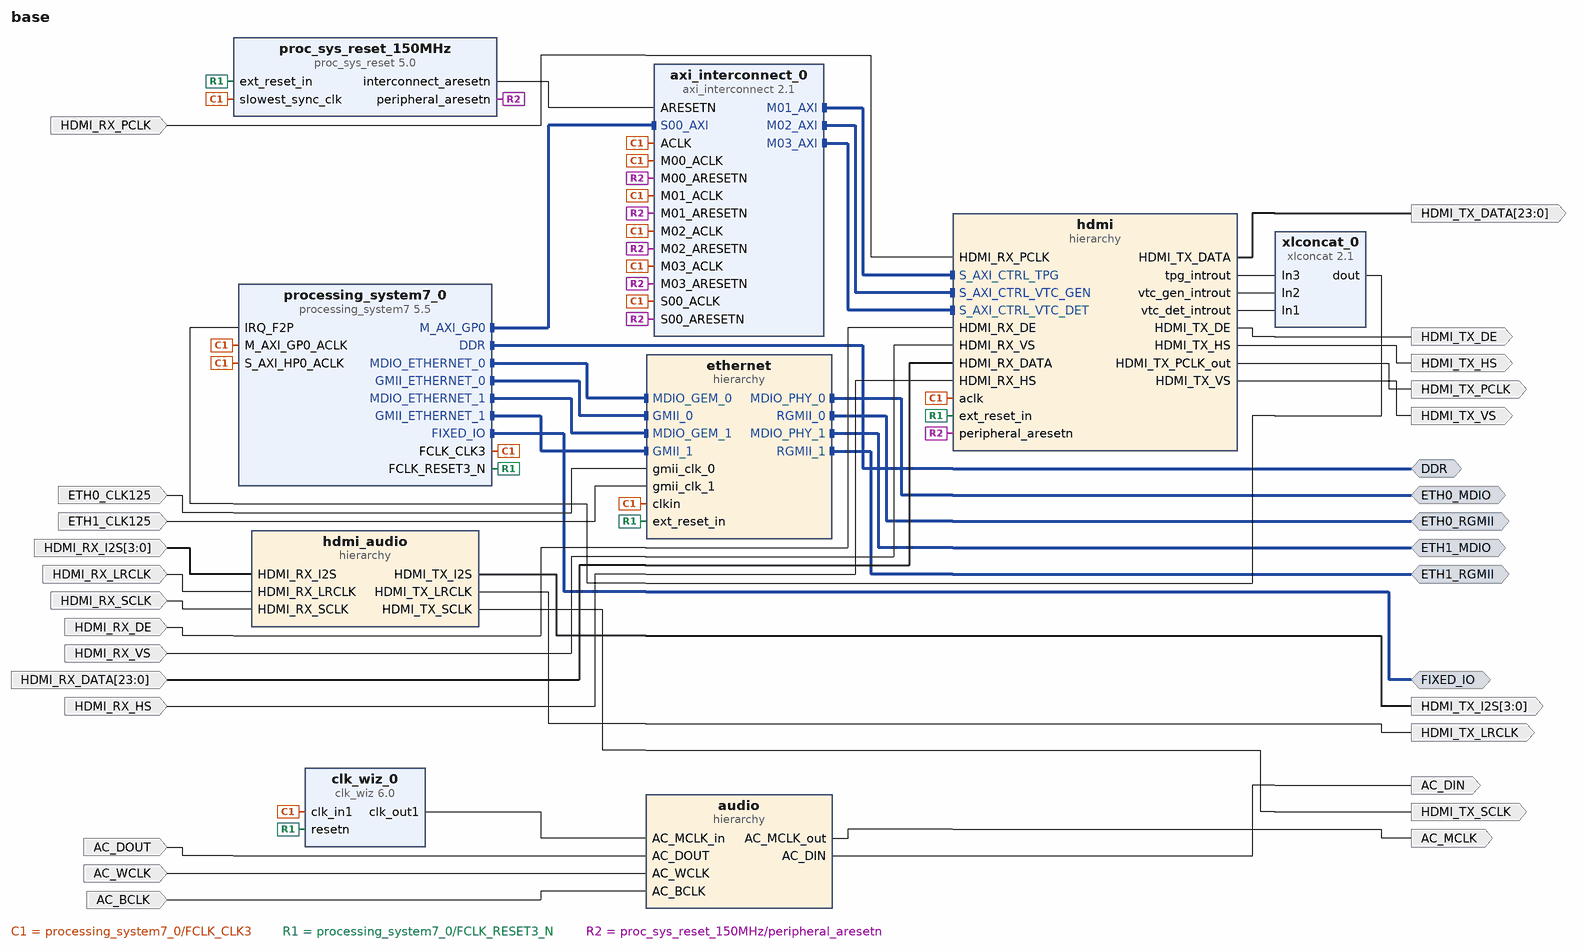
[diagram p0: block diagram of the top level]
# Vivado block design base, xc7z020clg400-3, Vivado 2018.2.1
create_bd_design base

create_bd_intf_port -mode Master -vlnv xilinx.com:interface:ddrx_rtl:1.0 DDR
create_bd_intf_port -mode Master -vlnv xilinx.com:display_processing_system7:fixedio_rtl:1.0 FIXED_IO
create_bd_intf_port -mode Master -vlnv xilinx.com:interface:mdio_rtl:1.0 ETH0_MDIO
create_bd_intf_port -mode Master -vlnv xilinx.com:interface:rgmii_rtl:1.0 ETH0_RGMII
create_bd_intf_port -mode Master -vlnv xilinx.com:interface:mdio_rtl:1.0 ETH1_MDIO
create_bd_intf_port -mode Master -vlnv xilinx.com:interface:rgmii_rtl:1.0 ETH1_RGMII
create_bd_port -dir I -type clk HDMI_RX_PCLK
set_property -dict {CONFIG.FREQ_HZ 148500000} [get_bd_ports HDMI_RX_PCLK]
create_bd_port -dir I -type data AC_DOUT
create_bd_port -dir O -from 23 -to 0 HDMI_TX_DATA
create_bd_port -dir O HDMI_TX_DE
create_bd_port -dir O HDMI_TX_HS
create_bd_port -dir O HDMI_TX_VS
create_bd_port -dir I HDMI_RX_DE
create_bd_port -dir I HDMI_RX_VS
create_bd_port -dir I -from 23 -to 0 -type data HDMI_RX_DATA
create_bd_port -dir I HDMI_RX_HS
create_bd_port -dir O AC_MCLK
create_bd_port -dir O -type data AC_DIN
create_bd_port -dir I AC_WCLK
create_bd_port -dir I AC_BCLK
create_bd_port -dir I -from 3 -to 0 HDMI_RX_I2S
create_bd_port -dir O -from 3 -to 0 HDMI_TX_I2S
create_bd_port -dir I HDMI_RX_LRCLK
create_bd_port -dir I HDMI_RX_SCLK
create_bd_port -dir O HDMI_TX_LRCLK
create_bd_port -dir O HDMI_TX_SCLK
create_bd_port -dir I -type clk ETH0_CLK125
set_property -dict {CONFIG.FREQ_HZ 125000000} [get_bd_ports ETH0_CLK125]
create_bd_port -dir O -type clk HDMI_TX_PCLK
create_bd_port -dir I -type clk ETH1_CLK125
set_property -dict {CONFIG.FREQ_HZ 125000000 CONFIG.CLK_DOMAIN base_gmii_clk_0} [get_bd_ports ETH1_CLK125]

create_bd_cell -type ip -vlnv xilinx.com:ip:xlconcat:2.1 xlconcat_0
set_property -dict {CONFIG.NUM_PORTS 6 CONFIG.IN0_WIDTH 11} [get_bd_cells xlconcat_0]
create_bd_cell -type ip -vlnv xilinx.com:ip:processing_system7:5.5 processing_system7_0
set_property -dict [list \
  CONFIG.PCW_UIPARAM_DDR_FREQ_MHZ 400 \
  CONFIG.PCW_CPU_CPU_6X4X_MAX_RANGE 867 \
  CONFIG.PCW_CRYSTAL_PERIPHERAL_FREQMHZ 33.333 \
  CONFIG.PCW_APU_PERIPHERAL_FREQMHZ 867 \
  CONFIG.PCW_SDIO_PERIPHERAL_FREQMHZ 100 \
  CONFIG.PCW_UART_PERIPHERAL_FREQMHZ 50 \
  CONFIG.PCW_I2C_PERIPHERAL_FREQMHZ 144.442993 \
  CONFIG.PCW_FPGA0_PERIPHERAL_FREQMHZ 50 \
  CONFIG.PCW_FPGA1_PERIPHERAL_FREQMHZ 100 \
  CONFIG.PCW_FPGA2_PERIPHERAL_FREQMHZ 150 \
  CONFIG.PCW_FPGA3_PERIPHERAL_FREQMHZ 200 \
  CONFIG.PCW_USE_S_AXI_HP0 1 \
  CONFIG.PCW_USE_FABRIC_INTERRUPT 1 \
  CONFIG.PCW_S_AXI_HP0_DATA_WIDTH 32 \
  CONFIG.PCW_EN_CLK1_PORT 1 \
  CONFIG.PCW_EN_CLK2_PORT 1 \
  CONFIG.PCW_EN_CLK3_PORT 1 \
  CONFIG.PCW_EN_RST1_PORT 1 \
  CONFIG.PCW_EN_RST2_PORT 1 \
  CONFIG.PCW_EN_RST3_PORT 1 \
  CONFIG.PCW_IRQ_F2P_INTR 1 \
  CONFIG.PCW_PERIPHERAL_BOARD_PRESET part0 \
  CONFIG.PCW_PRESET_BANK0_VOLTAGE {LVCMOS 1.8V} \
  CONFIG.PCW_PRESET_BANK1_VOLTAGE {LVCMOS 1.8V} \
  CONFIG.PCW_UIPARAM_DDR_MEMORY_TYPE {LPDDR 2} \
  CONFIG.PCW_UIPARAM_DDR_PARTNO Custom \
  CONFIG.PCW_QSPI_PERIPHERAL_ENABLE 1 \
  CONFIG.PCW_QSPI_QSPI_IO {MIO 1 .. 6} \
  CONFIG.PCW_QSPI_GRP_SINGLE_SS_ENABLE 1 \
  CONFIG.PCW_QSPI_GRP_SINGLE_SS_IO {MIO 1 .. 6} \
  CONFIG.PCW_SINGLE_QSPI_DATA_MODE x4 \
  CONFIG.PCW_QSPI_GRP_FBCLK_ENABLE 1 \
  CONFIG.PCW_QSPI_GRP_FBCLK_IO {MIO 8} \
  CONFIG.PCW_ENET0_PERIPHERAL_ENABLE 1 \
  CONFIG.PCW_ENET0_ENET0_IO EMIO \
  CONFIG.PCW_ENET0_GRP_MDIO_ENABLE 1 \
  CONFIG.PCW_ENET0_GRP_MDIO_IO EMIO \
  CONFIG.PCW_ENET_RESET_ENABLE 1 \
  CONFIG.PCW_ENET_RESET_SELECT {Share reset pin} \
  CONFIG.PCW_ENET0_RESET_ENABLE 0 \
  CONFIG.PCW_ENET1_PERIPHERAL_ENABLE 1 \
  CONFIG.PCW_ENET1_ENET1_IO EMIO \
  CONFIG.PCW_ENET1_GRP_MDIO_ENABLE 1 \
  CONFIG.PCW_ENET1_GRP_MDIO_IO EMIO \
  CONFIG.PCW_SD0_PERIPHERAL_ENABLE 1 \
  CONFIG.PCW_SD0_SD0_IO {MIO 40 .. 45} \
  CONFIG.PCW_SD0_GRP_CD_ENABLE 0 \
  CONFIG.PCW_SD0_GRP_WP_ENABLE 0 \
  CONFIG.PCW_SD1_PERIPHERAL_ENABLE 1 \
  CONFIG.PCW_SD1_SD1_IO {MIO 10 .. 15} \
  CONFIG.PCW_UART0_PERIPHERAL_ENABLE 1 \
  CONFIG.PCW_UART0_UART0_IO {MIO 50 .. 51} \
  CONFIG.PCW_UART1_PERIPHERAL_ENABLE 0 \
  CONFIG.PCW_SPI1_PERIPHERAL_ENABLE 1 \
  CONFIG.PCW_SPI1_SPI1_IO {MIO 46 .. 51} \
  CONFIG.PCW_USB0_PERIPHERAL_ENABLE 1 \
  CONFIG.PCW_USB0_USB0_IO {MIO 28 .. 39} \
  CONFIG.PCW_USB_RESET_ENABLE 1 \
  CONFIG.PCW_USB_RESET_SELECT {Share reset pin} \
  CONFIG.PCW_USB0_RESET_ENABLE 0 \
  CONFIG.PCW_I2C1_PERIPHERAL_ENABLE 1 \
  CONFIG.PCW_I2C1_I2C1_IO {MIO 24 .. 25} \
  CONFIG.PCW_I2C_RESET_ENABLE 1 \
  CONFIG.PCW_I2C_RESET_SELECT {Share reset pin} \
  CONFIG.PCW_GPIO_PERIPHERAL_ENABLE 1 \
  CONFIG.PCW_GPIO_MIO_GPIO_ENABLE 1 \
  CONFIG.PCW_GPIO_MIO_GPIO_IO MIO \
  CONFIG.PCW_GPIO_EMIO_GPIO_ENABLE 1 \
  CONFIG.PCW_GPIO_EMIO_GPIO_IO 64 \
  CONFIG.PCW_FPGA_FCLK1_ENABLE 1 \
  CONFIG.PCW_FPGA_FCLK2_ENABLE 1 \
  CONFIG.PCW_FPGA_FCLK3_ENABLE 1 \
] [get_bd_cells processing_system7_0]
# 527 more settings of processing_system7_0 are not shown: defaults, MIO pin electricals, DDR timing, and values the tool derives
create_bd_cell -type hier hdmi
create_bd_cell -type hier ethernet
create_bd_cell -type ip -vlnv xilinx.com:ip:axi_interconnect:2.1 axi_interconnect_0
set_property -dict {CONFIG.NUM_MI 4} [get_bd_cells axi_interconnect_0]
create_bd_cell -type ip -vlnv xilinx.com:ip:proc_sys_reset:5.0 proc_sys_reset_150MHz
create_bd_cell -type hier audio
create_bd_cell -type hier hdmi_audio
create_bd_cell -type ip -vlnv xilinx.com:ip:clk_wiz:6.0 clk_wiz_0
set_property -dict [list \
  CONFIG.USE_DYN_RECONFIG false \
  CONFIG.CLKOUT2_USED false \
  CONFIG.NUM_OUT_CLKS 1 \
  CONFIG.CLKOUT1_REQUESTED_OUT_FREQ 12 \
  CONFIG.CLKOUT2_REQUESTED_OUT_FREQ 12 \
  CONFIG.PRIM_SOURCE Global_buffer \
  CONFIG.RESET_PORT resetn \
  CONFIG.MMCM_DIVCLK_DIVIDE 11 \
  CONFIG.MMCM_CLKFBOUT_MULT_F 54.125 \
  CONFIG.MMCM_CLKIN2_PERIOD 10.0 \
  CONFIG.MMCM_CLKOUT0_DIVIDE_F 82.000 \
  CONFIG.MMCM_CLKOUT1_DIVIDE 1 \
  CONFIG.RESET_TYPE ACTIVE_LOW \
  CONFIG.CLKOUT1_JITTER 353.202 \
  CONFIG.CLKOUT1_PHASE_ERROR 344.060 \
  CONFIG.CLKOUT2_JITTER 353.202 \
  CONFIG.CLKOUT2_PHASE_ERROR 344.060 \
  CONFIG.AXI_DRP false \
  CONFIG.PHASE_DUTY_CONFIG false \
] [get_bd_cells clk_wiz_0]

# ---- hierarchy /hdmi ----
current_bd_instance /hdmi
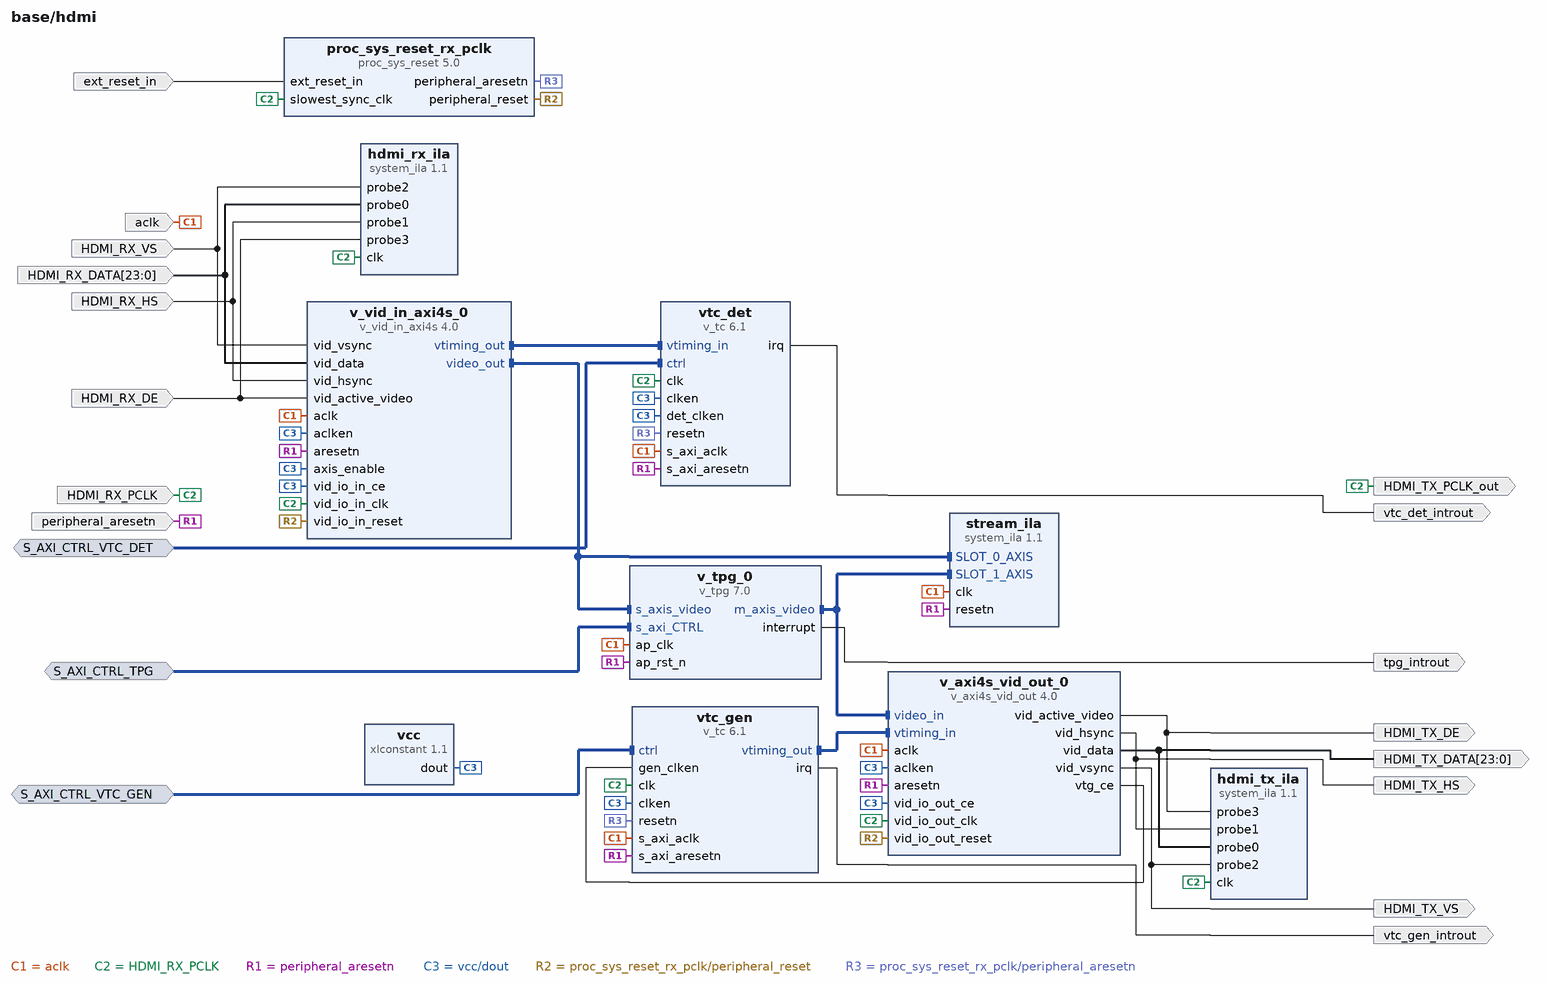
[diagram p1: block diagram inside /hdmi]
create_bd_intf_pin -mode Slave -vlnv xilinx.com:interface:aximm_rtl:1.0 S_AXI_CTRL_TPG
create_bd_intf_pin -mode Slave -vlnv xilinx.com:interface:aximm_rtl:1.0 S_AXI_CTRL_VTC_GEN
create_bd_intf_pin -mode Slave -vlnv xilinx.com:interface:aximm_rtl:1.0 S_AXI_CTRL_VTC_DET
create_bd_pin -dir I -type clk aclk
create_bd_pin -dir I -type rst ext_reset_in
create_bd_pin -dir I -type clk HDMI_RX_PCLK
create_bd_pin -dir O -from 23 -to 0 HDMI_TX_DATA
create_bd_pin -dir O HDMI_TX_DE
create_bd_pin -dir O HDMI_TX_HS
create_bd_pin -dir O HDMI_TX_VS
create_bd_pin -dir I HDMI_RX_DE
create_bd_pin -dir I HDMI_RX_VS
create_bd_pin -dir I -from 23 -to 0 HDMI_RX_DATA
create_bd_pin -dir I HDMI_RX_HS
create_bd_pin -dir O -type intr vtc_gen_introut
create_bd_pin -dir O tpg_introut
create_bd_pin -dir I -type rst peripheral_aresetn
create_bd_pin -dir O -type intr vtc_det_introut
create_bd_pin -dir O HDMI_TX_PCLK_out

create_bd_cell -type ip -vlnv xilinx.com:ip:v_axi4s_vid_out:4.0 v_axi4s_vid_out_0
set_property -dict {CONFIG.C_HAS_ASYNC_CLK 1 CONFIG.C_ADDR_WIDTH 5 CONFIG.C_VTG_MASTER_SLAVE 0} [get_bd_cells v_axi4s_vid_out_0]
create_bd_cell -type ip -vlnv xilinx.com:ip:system_ila:1.1 hdmi_tx_ila
set_property -dict [list \
  CONFIG.C_PROBE0_TYPE 1 \
  CONFIG.C_PROBE0_WIDTH 24 \
  CONFIG.C_DATA_DEPTH 4096 \
  CONFIG.C_NUM_OF_PROBES 4 \
  CONFIG.C_MON_TYPE NATIVE \
  CONFIG.C_PROBE_WIDTH_PROPAGATION MANUAL \
] [get_bd_cells hdmi_tx_ila]
create_bd_cell -type ip -vlnv xilinx.com:ip:xlconstant:1.1 vcc
create_bd_cell -type ip -vlnv xilinx.com:ip:system_ila:1.1 stream_ila
set_property -dict [list \
  CONFIG.C_SLOT 0 \
  CONFIG.C_DATA_DEPTH 4096 \
  CONFIG.C_NUM_OF_PROBES 1 \
  CONFIG.C_NUM_MONITOR_SLOTS 2 \
  CONFIG.C_SLOT_0_INTF_TYPE xilinx.com:interface:axis_rtl:1.0 \
  CONFIG.C_SLOT_1_INTF_TYPE xilinx.com:interface:axis_rtl:1.0 \
  CONFIG.C_SLOT_2_INTF_TYPE xilinx.com:interface:axis_rtl:1.0 \
  CONFIG.C_MON_TYPE INTERFACE \
  CONFIG.C_PROBE_WIDTH_PROPAGATION AUTO \
] [get_bd_cells stream_ila]
create_bd_cell -type ip -vlnv xilinx.com:ip:v_vid_in_axi4s:4.0 v_vid_in_axi4s_0
set_property -dict {CONFIG.C_HAS_ASYNC_CLK 1 CONFIG.C_ADDR_WIDTH 12} [get_bd_cells v_vid_in_axi4s_0]
create_bd_cell -type ip -vlnv xilinx.com:ip:proc_sys_reset:5.0 proc_sys_reset_rx_pclk
create_bd_cell -type ip -vlnv xilinx.com:ip:system_ila:1.1 hdmi_rx_ila
set_property -dict [list \
  CONFIG.C_PROBE0_TYPE 1 \
  CONFIG.C_PROBE0_WIDTH 24 \
  CONFIG.C_DATA_DEPTH 4096 \
  CONFIG.C_NUM_OF_PROBES 4 \
  CONFIG.C_MON_TYPE NATIVE \
  CONFIG.C_PROBE_WIDTH_PROPAGATION MANUAL \
] [get_bd_cells hdmi_rx_ila]
create_bd_cell -type ip -vlnv xilinx.com:ip:v_tc:6.1 vtc_gen
set_property -dict [list \
  CONFIG.HAS_AXI4_LITE true \
  CONFIG.HAS_INTC_IF false \
  CONFIG.VIDEO_MODE 1080p \
  CONFIG.enable_detection false \
  CONFIG.vertical_blank_generation true \
  CONFIG.horizontal_blank_generation true \
] [get_bd_cells vtc_gen]
create_bd_cell -type ip -vlnv xilinx.com:ip:v_tpg:7.0 v_tpg_0
set_property -dict {CONFIG.HAS_AXI4S_SLAVE 1} [get_bd_cells v_tpg_0]
create_bd_cell -type ip -vlnv xilinx.com:ip:v_tc:6.1 vtc_det
set_property -dict [list \
  CONFIG.HAS_AXI4_LITE true \
  CONFIG.HAS_INTC_IF false \
  CONFIG.VIDEO_MODE Custom \
  CONFIG.GEN_F0_VSYNC_VSTART 773 \
  CONFIG.GEN_HACTIVE_SIZE 1366 \
  CONFIG.GEN_HSYNC_END 1572 \
  CONFIG.GEN_HFRAME_SIZE 1792 \
  CONFIG.GEN_F0_VSYNC_HSTART 1366 \
  CONFIG.GEN_F0_VSYNC_HEND 1366 \
  CONFIG.GEN_F0_VFRAME_SIZE 798 \
  CONFIG.GEN_F0_VSYNC_VEND 778 \
  CONFIG.GEN_F0_VBLANK_HEND 1366 \
  CONFIG.GEN_HSYNC_START 1532 \
  CONFIG.GEN_VACTIVE_SIZE 768 \
  CONFIG.GEN_F0_VBLANK_HSTART 1366 \
  CONFIG.enable_generation false \
] [get_bd_cells vtc_det]

# ---- hierarchy /ethernet ----
current_bd_instance /ethernet
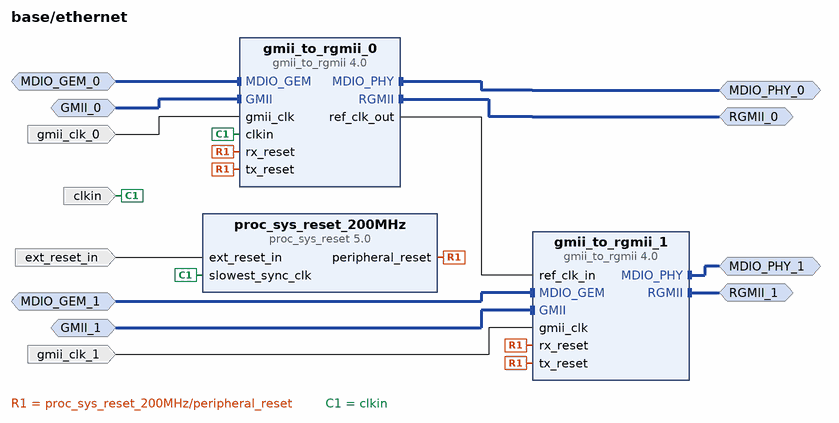
[diagram p2: block diagram inside /ethernet]
create_bd_intf_pin -mode Master -vlnv xilinx.com:interface:mdio_rtl:1.0 MDIO_PHY_0
create_bd_intf_pin -mode Master -vlnv xilinx.com:interface:rgmii_rtl:1.0 RGMII_0
create_bd_intf_pin -mode Slave -vlnv xilinx.com:interface:mdio_rtl:1.0 MDIO_GEM_0
create_bd_intf_pin -mode Slave -vlnv xilinx.com:interface:gmii_rtl:1.0 GMII_0
create_bd_intf_pin -mode Master -vlnv xilinx.com:interface:mdio_rtl:1.0 MDIO_PHY_1
create_bd_intf_pin -mode Master -vlnv xilinx.com:interface:rgmii_rtl:1.0 RGMII_1
create_bd_intf_pin -mode Slave -vlnv xilinx.com:interface:mdio_rtl:1.0 MDIO_GEM_1
create_bd_intf_pin -mode Slave -vlnv xilinx.com:interface:gmii_rtl:1.0 GMII_1
create_bd_pin -dir I -type clk clkin
create_bd_pin -dir I -type rst ext_reset_in
create_bd_pin -dir I -type clk gmii_clk_0
create_bd_pin -dir I gmii_clk_1

create_bd_cell -type ip -vlnv xilinx.com:ip:gmii_to_rgmii:4.0 gmii_to_rgmii_0
set_property -dict [list \
  CONFIG.C_EXTERNAL_CLOCK true \
  CONFIG.C_USE_IDELAY_CTRL true \
  CONFIG.RGMII_TXC_SKEW 0 \
  CONFIG.SupportLevel Include_Shared_Logic_in_Core \
] [get_bd_cells gmii_to_rgmii_0]
create_bd_cell -type ip -vlnv xilinx.com:ip:gmii_to_rgmii:4.0 gmii_to_rgmii_1
set_property -dict [list \
  CONFIG.C_EXTERNAL_CLOCK true \
  CONFIG.C_PHYADDR 9 \
  CONFIG.SupportLevel Include_Shared_Logic_in_Example_Design \
] [get_bd_cells gmii_to_rgmii_1]
create_bd_cell -type ip -vlnv xilinx.com:ip:proc_sys_reset:5.0 proc_sys_reset_200MHz

# ---- hierarchy /audio ----
current_bd_instance /audio
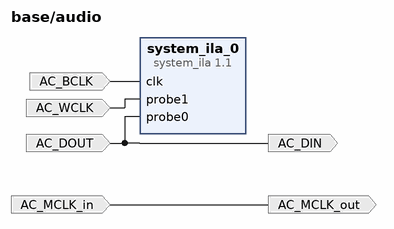
[diagram p3: block diagram inside /audio]
create_bd_pin -dir O -type clk AC_MCLK_out
create_bd_pin -dir I AC_DOUT
create_bd_pin -dir O AC_DIN
create_bd_pin -dir I AC_BCLK
create_bd_pin -dir I AC_WCLK
create_bd_pin -dir I AC_MCLK_in

create_bd_cell -type ip -vlnv xilinx.com:ip:system_ila:1.1 system_ila_0
set_property -dict {CONFIG.C_NUM_OF_PROBES 2 CONFIG.C_MON_TYPE NATIVE} [get_bd_cells system_ila_0]

# ---- hierarchy /hdmi_audio ----
current_bd_instance /hdmi_audio
create_bd_pin -dir I HDMI_RX_LRCLK
create_bd_pin -dir I HDMI_RX_SCLK
create_bd_pin -dir I -from 3 -to 0 HDMI_RX_I2S
create_bd_pin -dir O HDMI_TX_LRCLK
create_bd_pin -dir O HDMI_TX_SCLK
create_bd_pin -dir O -from 3 -to 0 HDMI_TX_I2S

# ---- connections ----

current_bd_instance /hdmi
connect_bd_intf_net [get_bd_intf_pins v_tpg_0/s_axis_video] [get_bd_intf_pins v_vid_in_axi4s_0/video_out]
connect_bd_intf_net [get_bd_intf_pins v_tpg_0/s_axis_video] [get_bd_intf_pins stream_ila/SLOT_0_AXIS]
connect_bd_intf_net [get_bd_intf_pins v_axi4s_vid_out_0/video_in] [get_bd_intf_pins v_tpg_0/m_axis_video]
connect_bd_intf_net [get_bd_intf_pins v_axi4s_vid_out_0/video_in] [get_bd_intf_pins stream_ila/SLOT_1_AXIS]
connect_bd_intf_net -intf_net v_tc_0_vtiming_out [get_bd_intf_pins v_axi4s_vid_out_0/vtiming_in] [get_bd_intf_pins vtc_gen/vtiming_out]
connect_bd_intf_net [get_bd_intf_pins v_vid_in_axi4s_0/vtiming_out] [get_bd_intf_pins vtc_det/vtiming_in]
connect_bd_intf_net [get_bd_intf_pins S_AXI_CTRL_TPG] [get_bd_intf_pins v_tpg_0/s_axi_CTRL]
connect_bd_intf_net [get_bd_intf_pins S_AXI_CTRL_VTC_GEN] [get_bd_intf_pins vtc_gen/ctrl]
connect_bd_intf_net [get_bd_intf_pins S_AXI_CTRL_VTC_DET] [get_bd_intf_pins vtc_det/ctrl]
connect_bd_net -net slowest_sync_clk_1 [get_bd_pins aclk] \
  [get_bd_pins v_axi4s_vid_out_0/aclk] [get_bd_pins stream_ila/clk] [get_bd_pins v_vid_in_axi4s_0/aclk] \
  [get_bd_pins v_tpg_0/ap_clk] [get_bd_pins vtc_gen/s_axi_aclk] [get_bd_pins vtc_det/s_axi_aclk]
connect_bd_net [get_bd_pins ext_reset_in] [get_bd_pins proc_sys_reset_rx_pclk/ext_reset_in]
connect_bd_net [get_bd_pins HDMI_RX_PCLK] \
  [get_bd_pins HDMI_TX_PCLK_out] [get_bd_pins v_vid_in_axi4s_0/vid_io_in_clk] \
  [get_bd_pins proc_sys_reset_rx_pclk/slowest_sync_clk] [get_bd_pins hdmi_rx_ila/clk] [get_bd_pins vtc_det/clk] \
  [get_bd_pins v_axi4s_vid_out_0/vid_io_out_clk] [get_bd_pins hdmi_tx_ila/clk] [get_bd_pins vtc_gen/clk]
connect_bd_net -net proc_sys_reset_100MHz_peripheral_aresetn [get_bd_pins peripheral_aresetn] \
  [get_bd_pins v_axi4s_vid_out_0/aresetn] [get_bd_pins stream_ila/resetn] [get_bd_pins v_vid_in_axi4s_0/aresetn] \
  [get_bd_pins v_tpg_0/ap_rst_n] [get_bd_pins vtc_gen/s_axi_aresetn] [get_bd_pins vtc_det/s_axi_aresetn]
connect_bd_net [get_bd_pins HDMI_RX_VS] [get_bd_pins v_vid_in_axi4s_0/vid_vsync] [get_bd_pins hdmi_rx_ila/probe2]
connect_bd_net [get_bd_pins HDMI_RX_DATA] [get_bd_pins v_vid_in_axi4s_0/vid_data] [get_bd_pins hdmi_rx_ila/probe0]
connect_bd_net [get_bd_pins HDMI_RX_HS] [get_bd_pins v_vid_in_axi4s_0/vid_hsync] [get_bd_pins hdmi_rx_ila/probe1]
connect_bd_net [get_bd_pins HDMI_RX_DE] [get_bd_pins v_vid_in_axi4s_0/vid_active_video] [get_bd_pins hdmi_rx_ila/probe3]
connect_bd_net -net hdmi_tx_HDMI_TX_DE [get_bd_pins v_axi4s_vid_out_0/vid_active_video] [get_bd_pins HDMI_TX_DE] [get_bd_pins hdmi_tx_ila/probe3]
connect_bd_net -net hdmi_tx_HDMI_TX_HS [get_bd_pins v_axi4s_vid_out_0/vid_hsync] [get_bd_pins HDMI_TX_HS] [get_bd_pins hdmi_tx_ila/probe1]
connect_bd_net -net hdmi_tx_HDMI_TX_VS [get_bd_pins v_axi4s_vid_out_0/vid_vsync] [get_bd_pins HDMI_TX_VS] [get_bd_pins hdmi_tx_ila/probe2]
connect_bd_net -net hdmi_tx_HDMI_TX_DATA [get_bd_pins v_axi4s_vid_out_0/vid_data] [get_bd_pins HDMI_TX_DATA] [get_bd_pins hdmi_tx_ila/probe0]
connect_bd_net -net hdmi_tx_vtc_introut [get_bd_pins vtc_gen/irq] [get_bd_pins vtc_gen_introut]
connect_bd_net -net capture_generate_tpg_introut [get_bd_pins v_tpg_0/interrupt] [get_bd_pins tpg_introut]
connect_bd_net [get_bd_pins vcc/dout] \
  [get_bd_pins v_axi4s_vid_out_0/vid_io_out_ce] [get_bd_pins v_axi4s_vid_out_0/aclken] \
  [get_bd_pins v_vid_in_axi4s_0/vid_io_in_ce] [get_bd_pins v_vid_in_axi4s_0/aclken] \
  [get_bd_pins v_vid_in_axi4s_0/axis_enable] [get_bd_pins vtc_gen/clken] [get_bd_pins vtc_det/clken] \
  [get_bd_pins vtc_det/det_clken]
connect_bd_net [get_bd_pins v_axi4s_vid_out_0/vtg_ce] [get_bd_pins vtc_gen/gen_clken]
connect_bd_net [get_bd_pins proc_sys_reset_rx_pclk/peripheral_reset] \
  [get_bd_pins v_vid_in_axi4s_0/vid_io_in_reset] [get_bd_pins v_axi4s_vid_out_0/vid_io_out_reset]
connect_bd_net [get_bd_pins proc_sys_reset_rx_pclk/peripheral_aresetn] [get_bd_pins vtc_det/resetn] [get_bd_pins vtc_gen/resetn]
connect_bd_net [get_bd_pins vtc_det/irq] [get_bd_pins vtc_det_introut]

current_bd_instance /ethernet
connect_bd_intf_net [get_bd_intf_pins MDIO_PHY_0] [get_bd_intf_pins gmii_to_rgmii_0/MDIO_PHY]
connect_bd_intf_net [get_bd_intf_pins RGMII_0] [get_bd_intf_pins gmii_to_rgmii_0/RGMII]
connect_bd_intf_net [get_bd_intf_pins MDIO_GEM_0] [get_bd_intf_pins gmii_to_rgmii_0/MDIO_GEM]
connect_bd_intf_net [get_bd_intf_pins GMII_0] [get_bd_intf_pins gmii_to_rgmii_0/GMII]
connect_bd_intf_net [get_bd_intf_pins MDIO_PHY_1] [get_bd_intf_pins gmii_to_rgmii_1/MDIO_PHY]
connect_bd_intf_net [get_bd_intf_pins RGMII_1] [get_bd_intf_pins gmii_to_rgmii_1/RGMII]
connect_bd_intf_net [get_bd_intf_pins MDIO_GEM_1] [get_bd_intf_pins gmii_to_rgmii_1/MDIO_GEM]
connect_bd_intf_net [get_bd_intf_pins GMII_1] [get_bd_intf_pins gmii_to_rgmii_1/GMII]
connect_bd_net -net rx_reset_1 [get_bd_pins proc_sys_reset_200MHz/peripheral_reset] \
  [get_bd_pins gmii_to_rgmii_0/rx_reset] [get_bd_pins gmii_to_rgmii_0/tx_reset] [get_bd_pins gmii_to_rgmii_1/rx_reset] \
  [get_bd_pins gmii_to_rgmii_1/tx_reset]
connect_bd_net [get_bd_pins clkin] [get_bd_pins gmii_to_rgmii_0/clkin] [get_bd_pins proc_sys_reset_200MHz/slowest_sync_clk]
connect_bd_net [get_bd_pins ext_reset_in] [get_bd_pins proc_sys_reset_200MHz/ext_reset_in]
connect_bd_net [get_bd_pins gmii_to_rgmii_0/ref_clk_out] [get_bd_pins gmii_to_rgmii_1/ref_clk_in]
connect_bd_net [get_bd_pins gmii_clk_0] [get_bd_pins gmii_to_rgmii_0/gmii_clk]
connect_bd_net -net gmii_clk_1_1 [get_bd_pins gmii_clk_1] [get_bd_pins gmii_to_rgmii_1/gmii_clk]

current_bd_instance /audio
connect_bd_net [get_bd_pins AC_BCLK] [get_bd_pins system_ila_0/clk]
connect_bd_net [get_bd_pins AC_DOUT] [get_bd_pins AC_DIN] [get_bd_pins system_ila_0/probe0]
connect_bd_net [get_bd_pins AC_WCLK] [get_bd_pins system_ila_0/probe1]
connect_bd_net [get_bd_pins AC_MCLK_in] [get_bd_pins AC_MCLK_out]

current_bd_instance /hdmi_audio
connect_bd_net [get_bd_pins HDMI_RX_I2S] [get_bd_pins HDMI_TX_I2S]
connect_bd_net [get_bd_pins HDMI_RX_SCLK] [get_bd_pins HDMI_TX_SCLK]
connect_bd_net [get_bd_pins HDMI_RX_LRCLK] [get_bd_pins HDMI_TX_LRCLK]

current_bd_instance /
connect_bd_intf_net [get_bd_intf_pins processing_system7_0/MDIO_ETHERNET_0] [get_bd_intf_pins ethernet/MDIO_GEM_0]
connect_bd_intf_net [get_bd_intf_pins processing_system7_0/GMII_ETHERNET_0] [get_bd_intf_pins ethernet/GMII_0]
connect_bd_intf_net [get_bd_intf_pins processing_system7_0/MDIO_ETHERNET_1] [get_bd_intf_pins ethernet/MDIO_GEM_1]
connect_bd_intf_net [get_bd_intf_pins processing_system7_0/GMII_ETHERNET_1] [get_bd_intf_pins ethernet/GMII_1]
connect_bd_intf_net [get_bd_intf_pins processing_system7_0/M_AXI_GP0] [get_bd_intf_pins axi_interconnect_0/S00_AXI]
connect_bd_intf_net [get_bd_intf_pins axi_interconnect_0/M01_AXI] [get_bd_intf_pins hdmi/S_AXI_CTRL_TPG]
connect_bd_intf_net [get_bd_intf_pins axi_interconnect_0/M02_AXI] [get_bd_intf_pins hdmi/S_AXI_CTRL_VTC_GEN]
connect_bd_intf_net [get_bd_intf_pins axi_interconnect_0/M03_AXI] [get_bd_intf_pins hdmi/S_AXI_CTRL_VTC_DET]
connect_bd_intf_net [get_bd_intf_ports DDR] [get_bd_intf_pins processing_system7_0/DDR]
connect_bd_intf_net [get_bd_intf_ports FIXED_IO] [get_bd_intf_pins processing_system7_0/FIXED_IO]
connect_bd_intf_net -intf_net ethernet_ETH0_MDIO [get_bd_intf_ports ETH0_MDIO] [get_bd_intf_pins ethernet/MDIO_PHY_0]
connect_bd_intf_net -intf_net ethernet_ETH0_RGMII [get_bd_intf_ports ETH0_RGMII] [get_bd_intf_pins ethernet/RGMII_0]
connect_bd_intf_net -intf_net ethernet_ETH1_MDIO [get_bd_intf_ports ETH1_MDIO] [get_bd_intf_pins ethernet/MDIO_PHY_1]
connect_bd_intf_net -intf_net ethernet_ETH1_RGMII [get_bd_intf_ports ETH1_RGMII] [get_bd_intf_pins ethernet/RGMII_1]
connect_bd_net [get_bd_pins processing_system7_0/FCLK_CLK3] \
  [get_bd_pins processing_system7_0/M_AXI_GP0_ACLK] [get_bd_pins processing_system7_0/S_AXI_HP0_ACLK] \
  [get_bd_pins proc_sys_reset_150MHz/slowest_sync_clk] [get_bd_pins clk_wiz_0/clk_in1] [get_bd_pins ethernet/clkin] \
  [get_bd_pins hdmi/aclk] [get_bd_pins axi_interconnect_0/ACLK] [get_bd_pins axi_interconnect_0/S00_ACLK] \
  [get_bd_pins axi_interconnect_0/M00_ACLK] [get_bd_pins axi_interconnect_0/M01_ACLK] \
  [get_bd_pins axi_interconnect_0/M02_ACLK] [get_bd_pins axi_interconnect_0/M03_ACLK]
connect_bd_net [get_bd_ports HDMI_RX_PCLK] [get_bd_pins hdmi/HDMI_RX_PCLK]
connect_bd_net [get_bd_pins xlconcat_0/dout] [get_bd_pins processing_system7_0/IRQ_F2P]
connect_bd_net -net AC_DIN_1 [get_bd_ports AC_DOUT] [get_bd_pins audio/AC_DOUT]
connect_bd_net [get_bd_pins hdmi/HDMI_TX_DATA] [get_bd_ports HDMI_TX_DATA]
connect_bd_net [get_bd_pins hdmi/HDMI_TX_DE] [get_bd_ports HDMI_TX_DE]
connect_bd_net [get_bd_pins hdmi/HDMI_TX_HS] [get_bd_ports HDMI_TX_HS]
connect_bd_net [get_bd_pins hdmi/HDMI_TX_VS] [get_bd_ports HDMI_TX_VS]
connect_bd_net [get_bd_ports HDMI_RX_DE] [get_bd_pins hdmi/HDMI_RX_DE]
connect_bd_net [get_bd_ports HDMI_RX_VS] [get_bd_pins hdmi/HDMI_RX_VS]
connect_bd_net [get_bd_ports HDMI_RX_DATA] [get_bd_pins hdmi/HDMI_RX_DATA]
connect_bd_net [get_bd_ports HDMI_RX_HS] [get_bd_pins hdmi/HDMI_RX_HS]
connect_bd_net [get_bd_pins processing_system7_0/FCLK_RESET3_N] \
  [get_bd_pins proc_sys_reset_150MHz/ext_reset_in] [get_bd_pins clk_wiz_0/resetn] [get_bd_pins ethernet/ext_reset_in] \
  [get_bd_pins hdmi/ext_reset_in]
connect_bd_net -net proc_sys_reset_100MHz_peripheral_aresetn [get_bd_pins proc_sys_reset_150MHz/peripheral_aresetn] \
  [get_bd_pins hdmi/peripheral_aresetn] [get_bd_pins axi_interconnect_0/S00_ARESETN] \
  [get_bd_pins axi_interconnect_0/M00_ARESETN] [get_bd_pins axi_interconnect_0/M01_ARESETN] \
  [get_bd_pins axi_interconnect_0/M02_ARESETN] [get_bd_pins axi_interconnect_0/M03_ARESETN]
connect_bd_net -net ARESETN_1 [get_bd_pins proc_sys_reset_150MHz/interconnect_aresetn] [get_bd_pins axi_interconnect_0/ARESETN]
connect_bd_net [get_bd_pins hdmi/tpg_introut] [get_bd_pins xlconcat_0/In3]
connect_bd_net [get_bd_pins hdmi/vtc_gen_introut] [get_bd_pins xlconcat_0/In2]
connect_bd_net [get_bd_pins hdmi/vtc_det_introut] [get_bd_pins xlconcat_0/In1]
connect_bd_net -net audio_AC_MCLK [get_bd_pins audio/AC_MCLK_out] [get_bd_ports AC_MCLK]
connect_bd_net [get_bd_pins audio/AC_DIN] [get_bd_ports AC_DIN]
connect_bd_net [get_bd_ports AC_WCLK] [get_bd_pins audio/AC_WCLK]
connect_bd_net [get_bd_ports AC_BCLK] [get_bd_pins audio/AC_BCLK]
connect_bd_net [get_bd_ports HDMI_RX_I2S] [get_bd_pins hdmi_audio/HDMI_RX_I2S]
connect_bd_net [get_bd_pins hdmi_audio/HDMI_TX_I2S] [get_bd_ports HDMI_TX_I2S]
connect_bd_net [get_bd_ports HDMI_RX_LRCLK] [get_bd_pins hdmi_audio/HDMI_RX_LRCLK]
connect_bd_net [get_bd_ports HDMI_RX_SCLK] [get_bd_pins hdmi_audio/HDMI_RX_SCLK]
connect_bd_net [get_bd_pins hdmi_audio/HDMI_TX_LRCLK] [get_bd_ports HDMI_TX_LRCLK]
connect_bd_net [get_bd_pins hdmi_audio/HDMI_TX_SCLK] [get_bd_ports HDMI_TX_SCLK]
connect_bd_net -net gmii_clk_0_1 [get_bd_ports ETH0_CLK125] [get_bd_pins ethernet/gmii_clk_0]
connect_bd_net [get_bd_pins hdmi/HDMI_TX_PCLK_out] [get_bd_ports HDMI_TX_PCLK]
connect_bd_net -net gmii_clk_1_1 [get_bd_ports ETH1_CLK125] [get_bd_pins ethernet/gmii_clk_1]
connect_bd_net -net AC_MCLK_in_1 [get_bd_pins clk_wiz_0/clk_out1] [get_bd_pins audio/AC_MCLK_in]

# ---- address map ----
assign_bd_address -offset 0x43C00000 -range 64K -target_address_space [get_bd_addr_spaces processing_system7_0/Data] [get_bd_addr_segs hdmi/v_tpg_0/s_axi_CTRL/Reg]
assign_bd_address -offset 0x43C10000 -range 64K -target_address_space [get_bd_addr_spaces processing_system7_0/Data] [get_bd_addr_segs hdmi/vtc_gen/ctrl/Reg]
assign_bd_address -offset 0x43C20000 -range 64K -target_address_space [get_bd_addr_spaces processing_system7_0/Data] [get_bd_addr_segs hdmi/vtc_det/ctrl/Reg]

validate_bd_design
save_bd_design
